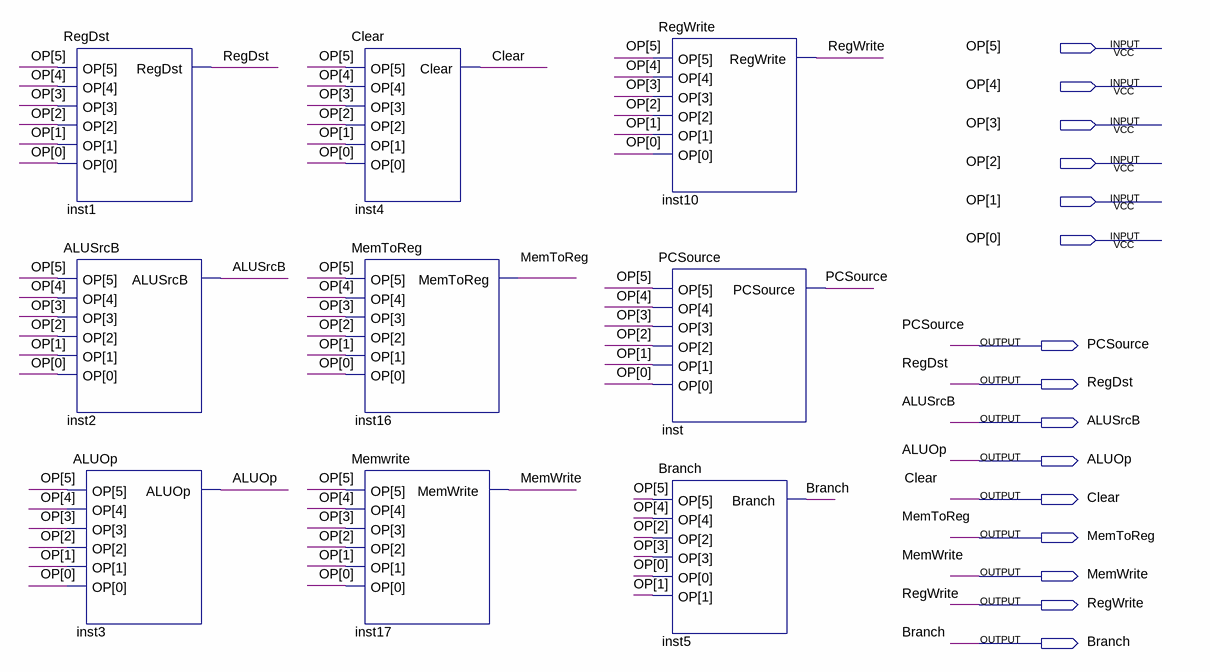
[diagram p0: schematic sheet]
// Quartus schematic Controller.bdf as structural Verilog: 9 symbols, 15 pins
module Controller (
  input  [5:0] OP,
  output PCSource,
  output RegDst,
  output ALUSrcB,
  output ALUOp,
  output Clear,
  output MemToReg,
  output MemWrite,
  output RegWrite,
  output Branch
);

  RegDst inst1 (.OP(OP), .RegDst(RegDst));
  ALUSrcB inst2 (.OP(OP), .ALUSrcB(ALUSrcB));
  ALUOp inst3 (.OP(OP), .ALUOp(ALUOp));
  Clear inst4 (.OP(OP), .Clear(Clear));
  MemToReg inst16 (.OP(OP), .MemToReg(MemToReg));
  Memwrite inst17 (.OP(OP), .MemWrite(MemWrite));
  RegWrite inst10 (.OP(OP), .RegWrite(RegWrite));
  PCSource inst (.OP(OP), .PCSource(PCSource));
  Branch inst5 (.OP(OP), .Branch(Branch));
endmodule
